# Altium schematic sheet 15.SchDoc
size 297 x 209 mm
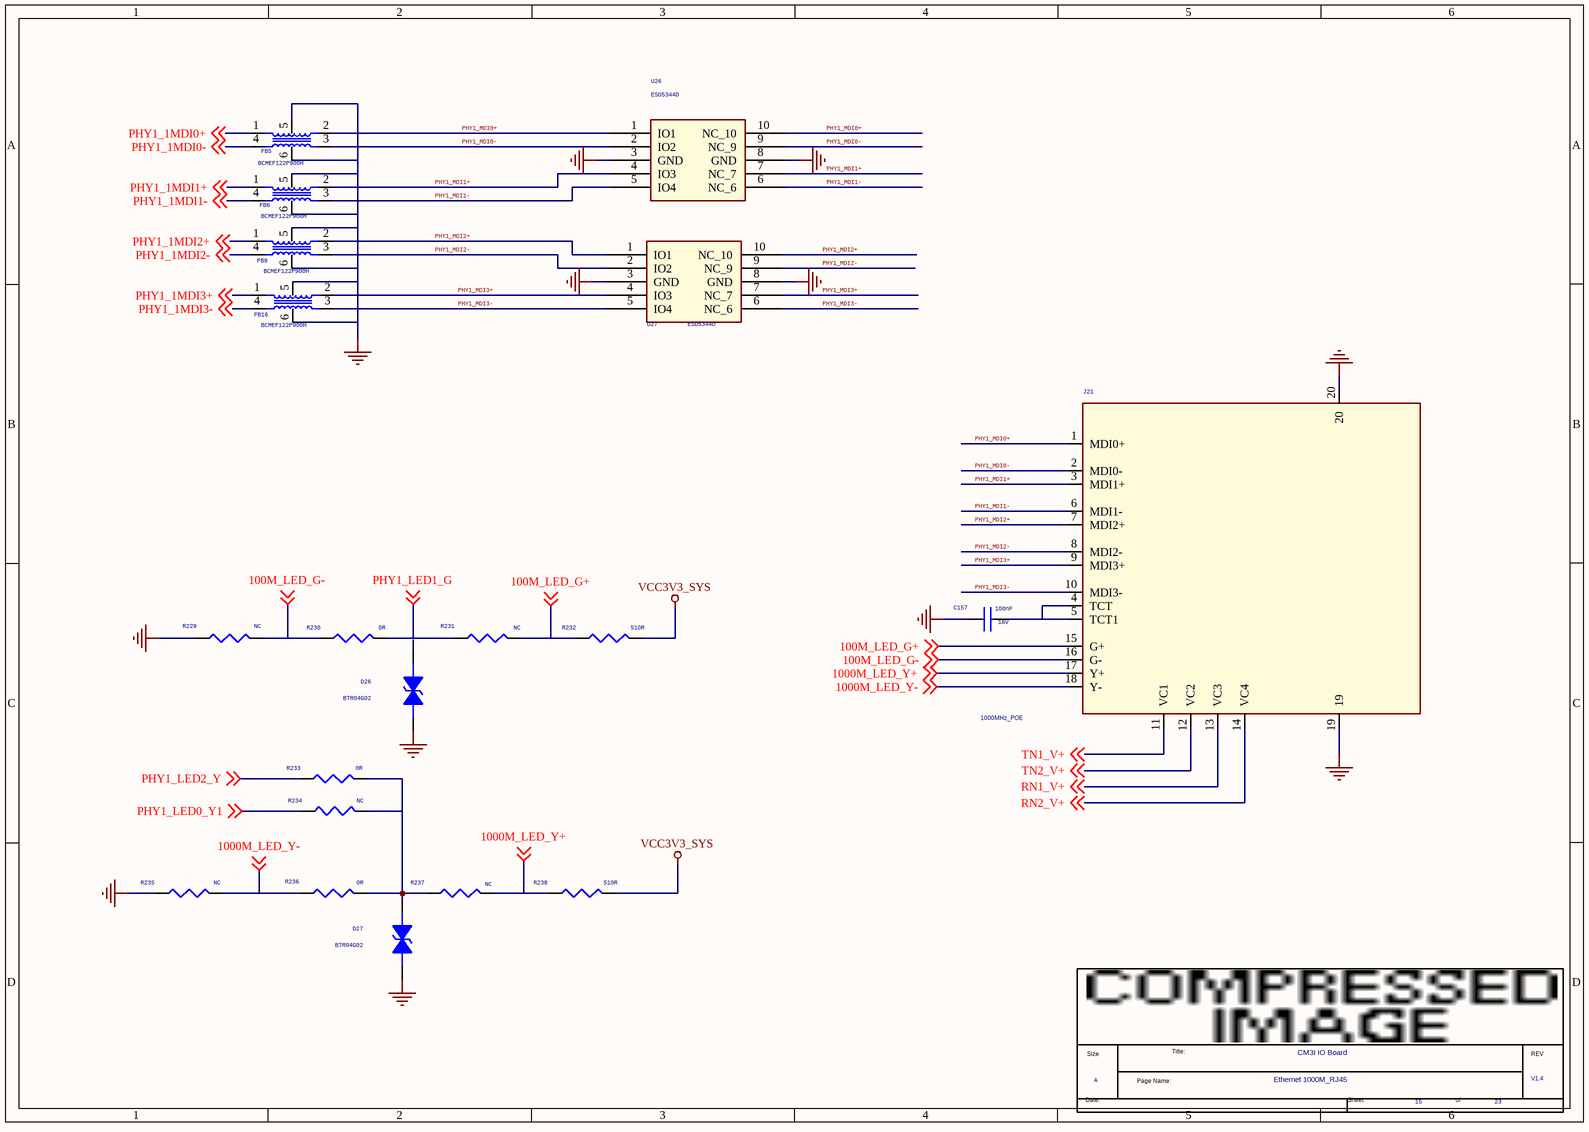
[diagram p0: 15.SchDoc]

## Parts
*  Page Count: 23  Page Number: 15  Page Size: A  Title: CM3I IO Board  RevCode: V1.4  Doc: Ethernet 1000M_RJ45  (hidden comment: radxa_1010)  (graphical)
C157  100nF  Voltage: 16V  [C0402]
D26  BTR04G02  [ESD0402_1xD5]
D27  BTR04G02  [ESD0402_1xD5]
FB5  BCMEF122P900H  [GMDG-6PIN_ESD]
FB6  BCMEF122P900H  [GMDG-6PIN_ESD]
FB9  BCMEF122P900H  [GMDG-6PIN_ESD]
FB16  BCMEF122P900H  [GMDG-6PIN_ESD]
J21  1000MHz_POE  [RJ45_PULSE]
R229  NC  [R0402]
R230  0R  [R0402]
R231  NC  [R0402]
R232  510R  [R0402]
R233  0R  [R0402]
R234  NC  [R0402]
R235  NC  [R0402]
R236  0R  [R0402]
R237  NC  [R0402]
R238  510R  [R0402]
U26  ESD5344D  [SON10_2R50X1R00X0R50]
U27  ESD5344D  [SON10_2R50X1R00X0R50]

## Nets
GND: C157.1 D26.1 D27.1 FB5.5 FB5.6 FB6.5 FB6.6 FB9.5 FB9.6 FB16.5 FB16.6 J21.19 J21.20 R229.1 R235.1 U26.3(GND) U26.8(GND) U27.3(GND) U27.8(GND)
VCC3V3_SYS: R232.2 R238.2
100M_LED_G+: J21.15(G+) R231.2 R232.1 ; off-sheet 100M_LED_G+
100M_LED_G-: J21.16(G-) R229.2 R230.1 ; off-sheet 100M_LED_G-
1000M_LED_Y+: J21.17(Y+) R237.2 R238.1 ; off-sheet 1000M_LED_Y+
1000M_LED_Y-: J21.18(Y-) R235.2 R236.1 ; off-sheet 1000M_LED_Y-
PHY1_1MDI0+: FB5.1(R1) ; off-sheet PHY1_1MDI0+
PHY1_1MDI0-: FB5.4(R2) ; off-sheet PHY1_1MDI0-
PHY1_1MDI1+: FB6.1(R1) ; off-sheet PHY1_1MDI1+
PHY1_1MDI1-: FB6.4(R2) ; off-sheet PHY1_1MDI1-
PHY1_1MDI2+: FB9.1(R1) ; off-sheet PHY1_1MDI2+
PHY1_1MDI2-: FB9.4(R2) ; off-sheet PHY1_1MDI2-
PHY1_1MDI3+: FB16.1(R1) ; off-sheet PHY1_1MDI3+
PHY1_1MDI3-: FB16.4(R2) ; off-sheet PHY1_1MDI3-
PHY1_LED0_Y1: R234.1 ; off-sheet PHY1_LED0_Y1
PHY1_LED1_G: R230.2 R231.1 ; off-sheet PHY1_LED1_G
PHY1_LED2_Y: R233.1 ; off-sheet PHY1_LED2_Y
PHY1_MDI0+: FB5.2(R4) J21.1(MDI0+) U26.1(IO1) U26.10(NC_10)
PHY1_MDI0-: FB5.3(R3) J21.2(MDI0-) U26.2(IO2) U26.9(NC_9)
PHY1_MDI1+: FB6.2(R4) J21.3(MDI1+) U26.4(IO3) U26.7(NC_7)
PHY1_MDI1-: FB6.3(R3) J21.6(MDI1-) U26.5(IO4) U26.6(NC_6)
PHY1_MDI2+: FB9.2(R4) J21.7(MDI2+) U27.1(IO1) U27.10(NC_10)
PHY1_MDI2-: FB9.3(R3) J21.8(MDI2-) U27.2(IO2) U27.9(NC_9)
PHY1_MDI3+: FB16.2(R4) J21.9(MDI3+) U27.4(IO3) U27.7(NC_7)
PHY1_MDI3-: FB16.3(R3) J21.10(MDI3-) U27.5(IO4) U27.6(NC_6)
RN1_V+: J21.13(VC3) ; off-sheet RN1_V+
RN2_V+: J21.14(VC4) ; off-sheet RN2_V+
TN1_V+: J21.11(VC1) ; off-sheet TN1_V+
TN2_V+: J21.12(VC2) ; off-sheet TN2_V+
NetC157_2: C157.2 J21.4(TCT) J21.5(TCT1)
NetD27_2: D27.2 R233.2 R234.2 R236.2 R237.1

Not connected (* = marked no-connect by the designer): D26 2

## Notes on the sheet
- (in symbol radxa_1010) Title:; Size; REV; Page Name:; Date:; Sheet; of

## Library data of the parts
C157 = CAP NP_0: cap,100.00nF,+/-10%,16V,X5R,C0402; Manufacturer: TDK; RK PN: C1005X5R1C104K050BA; Priority: A; Tolerance: 10%; Dielectric: X5R; Part Type: C0402; Manufacturer PN: C1005X5R1C104K050BA; Created by: JJJ
D26 D27 = DIODE BI_DIR TRIG_0: 1-Line, Bi-directional, Transient Voltage Suppressors.17.5pF.; Manufacturer: WillSemi(韦尔半导体); RK PN: ESD5451N; Priority: A; OPTION: DNP; Part Type: ESD_TVS; Manufacturer PN: ESD5451N; Created by: JJJ
FB5 FB6 FB9 FB16 = R-PACK4_0_Dup1
J21 = HR911130C_1: 千兆网口接口，内置变压器; VAL: J00-0061; DESIG: 10/100 base TX LXT971A; BOI: RJ45; FAB: PULSE; DEV: CON_PULSE_J00-61; Priority: A; REF: J00-0061; Created by: JJJ; Manufacturer Part Number: HR911130C; Part Type: Ethernet Jack; RK PN: HR911130C
R229 R233 R234 = RESISTOR_0_Dup1: 通用厚膜电阻,0R,+/-5%,R0402,1/16W.; Manufacturer PN: RC0402JR-070RL; Manufacturer: YAGEO; Tolerance: 5%; Wattage: 1/16W; Priority: A; Created by: YTL; Part Type: 通用厚膜电阻; RK PN: RC0402JR-070RL
R230 R235 R236 = RESISTOR_0_Dup1: 通用厚膜电阻,0R,+/-5%,R0402,1/16W.; Manufacturer: YAGEO; Tolerance: 5%; RK PN: RC0402JR-070RL; Priority: A; Wattage: 1/16W; Part Type: 通用厚膜电阻; Manufacturer PN: RC0402JR-070RL; Created by: YTL
R231 R237 = RESISTOR_0_Dup1: 通用厚膜电阻,0R,+/-5%,R0402,1/16W.; Manufacturer PN: RC0402JR-070RL; Manufacturer: YAGEO; Tolerance: 5%; option: DNP; Wattage: 1/16W; Priority: A; Created by: YTL; Part Type: 通用厚膜电阻; RK PN: RC0402JR-070RL
R232 = RESISTOR_0_Dup1: 通用厚膜电阻,510R,+/-5%,R0402,1/16W.; Manufacturer PN: RC0402JR-07510RL; Manufacturer: YAGEO; Tolerance: 5%; Wattage: 1/16W; Priority: A; Created by: YTL; Part Type: 通用厚膜电阻; RK PN: RC0402JR-07510RL
R238 = RESISTOR_0_Dup1: 通用厚膜电阻,510R,+/-5%,R0402,1/16W.; Manufacturer: YAGEO; Tolerance: 5%; RK PN: RC0402JR-07510RL; Priority: A; Wattage: 1/16W; Part Type: 通用厚膜电阻; Manufacturer PN: RC0402JR-07510RL; Created by: YTL
U26 U27 = ESD_ESD5304D: 4-Lines, Uni-directional, Ultra-low Capacitance Transient Voltage Suppressors; Manufacturer: WillSemi(韦尔半导体); Priority: A; RK PN: ESD5304D; Part Type: ESD_TVS; Manufacturer PN: ESD5304D; Created by: JJJ
* = radxa_1010: Page Create Date: March  8, 1995